# EAGLE schematic MotoRecoPico (EAGLE 9.6.2)
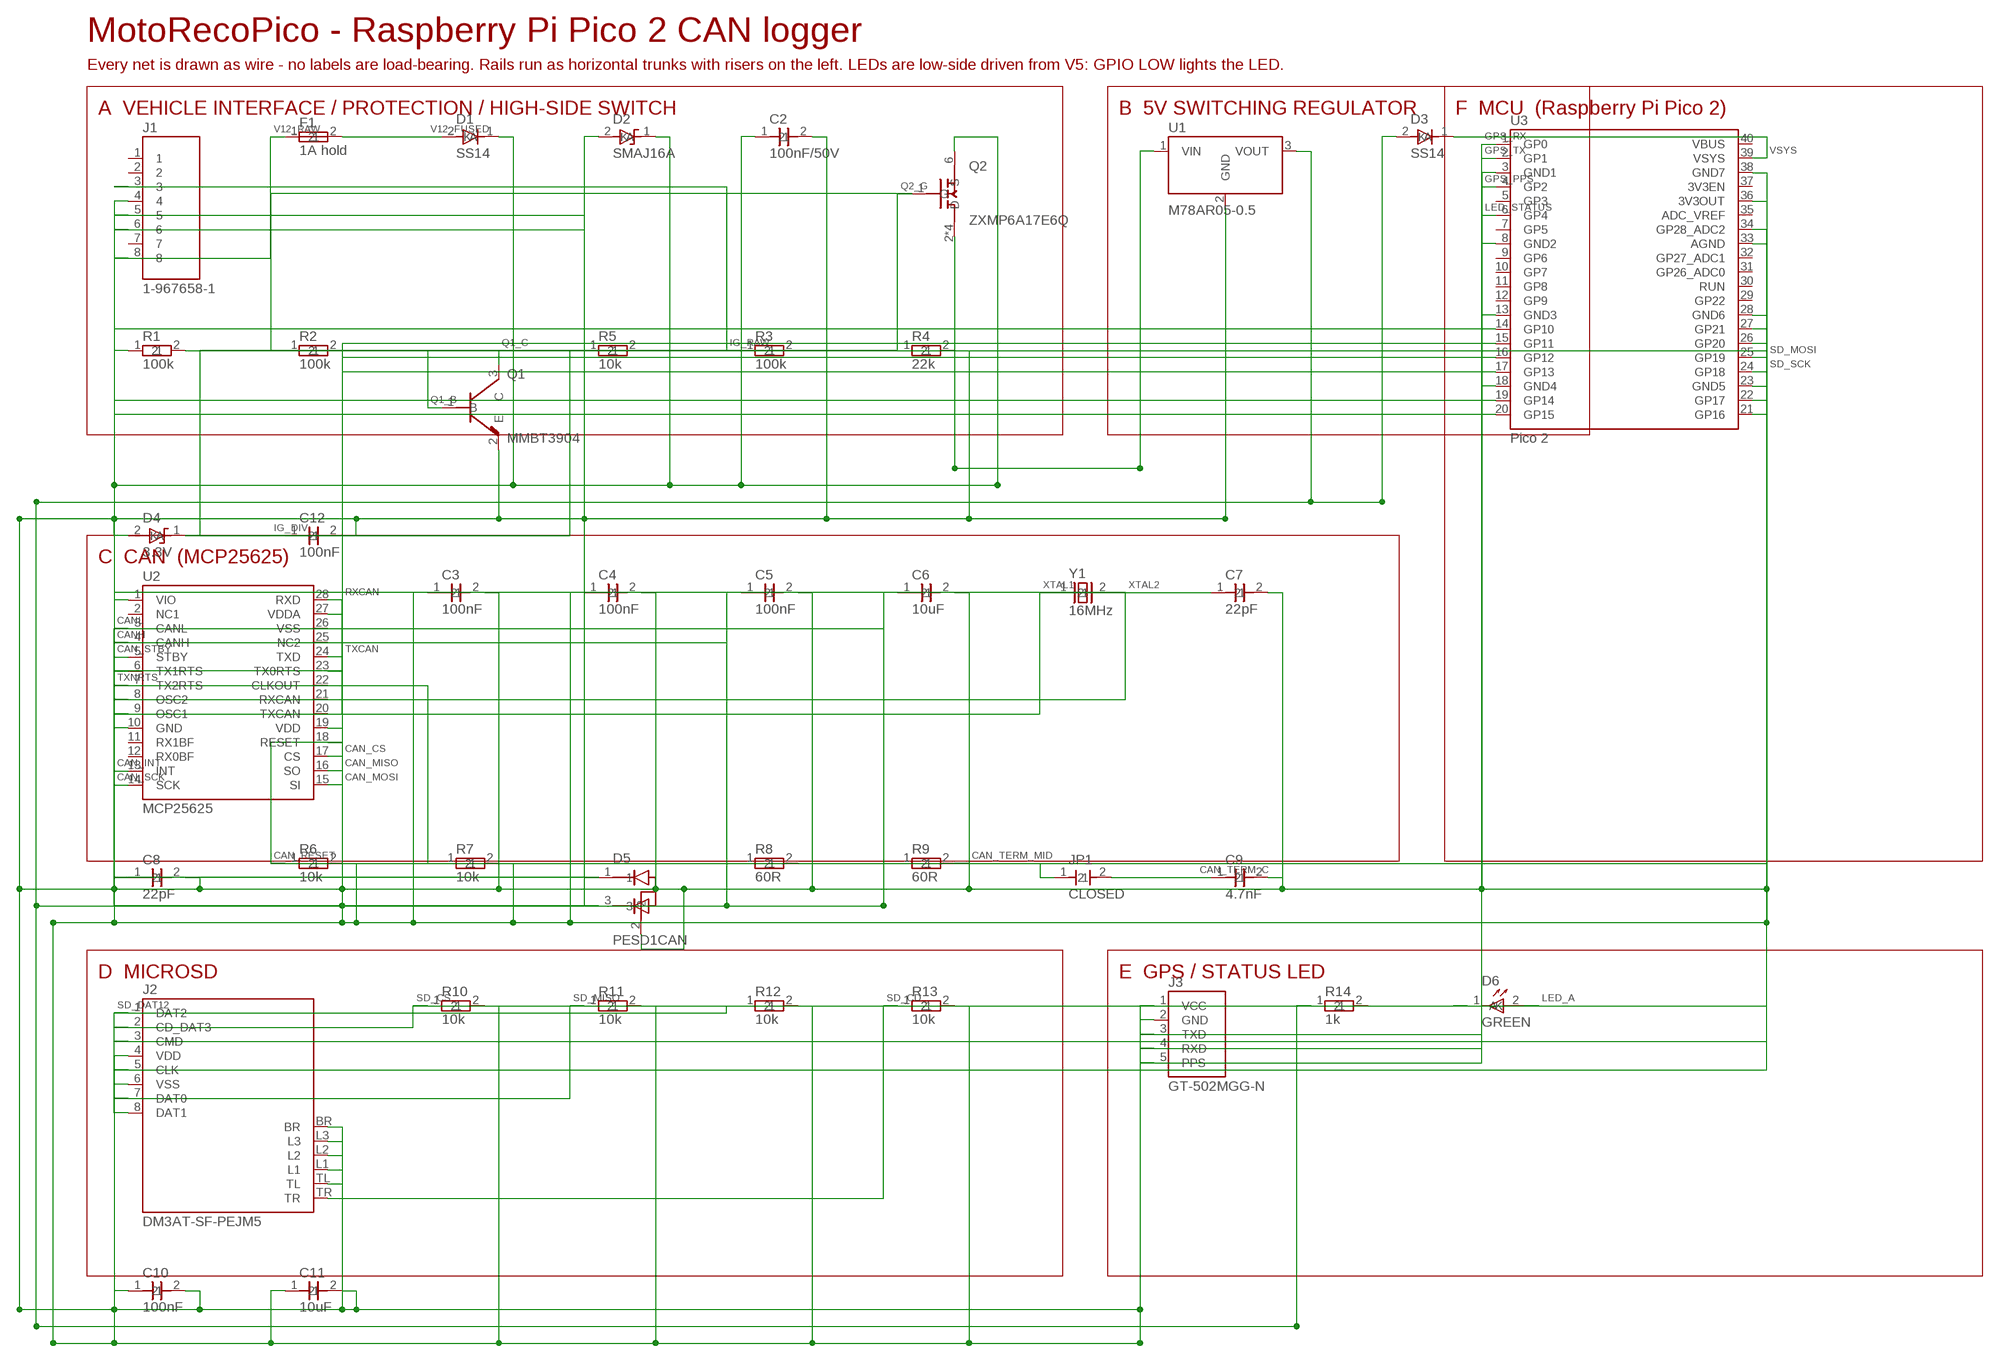
[diagram p0: schematic, sheet 1]

## Parts
C2  100nF/50V  C  [C1005]
C3  100nF  C  [C1005]
C4  100nF  C  [C1005]
C5  100nF  C  [C1005]
C6  10uF  C-1608  [C1608]
C7  22pF  C  [C1005]
C8  22pF  C  [C1005]
C9  4.7nF  C  [C1005]
C10  100nF  C  [C1005]
C11  10uF  C-1608  [C1608]
C12  100nF  C  [C1005]
D1  SS14  SCHOTTKY-1A  [SOD123]
D2  SMAJ16A  TVS-SMA  [SMA]
D3  SS14  SCHOTTKY-1A  [SOD123]
D4  3.3V  ZENER-3V3  [SOD123]
D5  PESD1CAN  [SOT23]
D6  GREEN  LED-SIDEVIEW  [LED-SIDE-2812]
F1  1A hold  PTC-FUSE  [C1206]
J1  1-967658-1  MQS-8-967658  [MQS-8-RA-967658]
J2  DM3AT-SF-PEJM5  MICROSD-DM3AT-SF-PEJM5  [MICROSD-DM3AT]
J3  GT-502MGG-N  [GPS-5P-SMD]
JP1  CLOSED  SOLDER-JUMPER  [SJ2]
Q1  MMBT3904  [SOT23]
Q2  ZXMP6A17E6Q  ZXMP6A17  [SOT26]
R1  100k  R  [C1005]
R2  100k  R  [C1005]
R3  100k  R  [C1005]
R4  22k  R  [C1005]
R5  10k  R  [C1005]
R6  10k  R  [C1005]
R7  10k  R  [C1005]
R8  60R  R  [C1005]
R9  60R  R  [C1005]
R10  10k  R  [C1005]
R11  10k  R  [C1005]
R12  10k  R  [C1005]
R13  10k  R  [C1005]
R14  1k  R  [C1005]
U1  M78AR05-0.5  [SIP3-M78AR05]
U2  MCP25625  MCP25625T-E/SS  [SSOP28]
U3  Pico 2  RPI-PICO2  [RPI-PICO2-THT]
Y1  16MHz  CRYSTAL  [HC49S]

## Nets
CAN_CS: U2.17(CS) U3.17(GP13)
CAN_INT: U2.13(INT) U3.19(GP14)
CAN_MISO: U2.16(SO) U3.16(GP12)
CAN_MOSI: U2.15(SI) U3.15(GP11)
CAN_RESET: R6.1 U2.18(RESET) U3.26(GP20)
CAN_SCK: U2.14(SCK) U3.14(GP10)
CAN_STBY: U2.5(STBY) U3.20(GP15)
CAN_TERM_C: C9.1 JP1.2
CAN_TERM_MID: JP1.1 R8.2 R9.2
CANH: D5.1 J1.6 R8.1 U2.4(CANH)
CANL: D5.3 J1.5 R9.1 U2.3(CANL)
GND: C2.2 C3.2 C4.2 C5.2 C6.2 C7.2 C8.2 C9.2 C10.2 C11.2 C12.2 D2.2(A) D4.2(A) D5.2 J1.4 J2.6(VSS) J2.BR J2.L1 J2.L2 J2.L3 J2.TL J3.2(GND) Q1.2(E) R4.2 U1.2(GND) U2.10(GND) U2.26(VSS) U3.3(GND1) U3.8(GND2) U3.13(GND3) U3.18(GND4) U3.23(GND5) U3.28(GND6) U3.33(AGND) U3.38(GND7)
GPS_PPS: J3.5(PPS) U3.4(GP2)
GPS_RX: J3.4(RXD) U3.1(GP0)
GPS_TX: J3.3(TXD) U3.2(GP1)
IG_DIV: C12.1 D4.1(K) R3.2 R4.1 R5.1 U3.34(GP28_ADC2)
IG_RAW: J1.3 R3.1
LED_A: D6.2(A) R14.2
LED_STATUS: D6.1(K) U3.6(GP4)
Q1_B: Q1.1(B) R5.2
Q1_C: Q1.3(C) R2.2
Q2_G: Q2.1(G) R1.2 R2.1
RXCAN: U2.21(RXCAN) U2.28(RXD)
SD_CD: J2.TR R13.1 U3.27(GP21)
SD_CS: J2.2(CD_DAT3) R10.1 U3.22(GP17)
SD_DAT12: J2.1(DAT2) J2.8(DAT1) R12.1
SD_MISO: J2.7(DAT0) R11.1 U3.21(GP16)
SD_MOSI: J2.3(CMD) U3.25(GP19)
SD_SCK: J2.5(CLK) U3.24(GP18)
TXCAN: U2.20(TXCAN) U2.24(TXD)
TXNRTS: R7.1 U2.6(TX1RTS) U2.7(TX2RTS) U2.23(TX0RTS)
V3V3: C3.1 C4.1 C10.1 C11.1 J2.4(VDD) J3.1(VCC) R6.2 R7.2 R10.2 R11.2 R12.2 R13.2 U2.1(VIO) U2.19(VDD) U3.36(3V3OUT)
V5: C5.1 C6.1 D3.2(A) R14.1 U1.3(VOUT) U2.27(VDDA)
V12_FUSED: D1.2(A) F1.2
V12_RAW: F1.1 J1.8
V12_SW: Q2.2(D) Q2.3(D) Q2.4(D) Q2.5(D) U1.1(VIN)
V12P: C2.1 D1.1(K) D2.1(K) Q2.6(S) R1.1
VSYS: D3.1(K) U3.39(VSYS)
XTAL1: C7.1 U2.9(OSC1) Y1.1
XTAL2: C8.1 U2.8(OSC2) Y1.2
Unconnected: J1.1 J1.2 J1.7 U2.2(NC1) U2.11(RX1BF) U2.12(RX0BF) U2.22(CLKOUT) U2.25(NC2) U3.5(GP3) U3.7(GP5) U3.9(GP6) U3.10(GP7) U3.11(GP8) U3.12(GP9) U3.29(GP22) U3.30(RUN) U3.31(GP26_ADC0) U3.32(GP27_ADC1) U3.35(ADC_VREF) U3.37(3V3EN) U3.40(VBUS)

## Notes on the sheet
- MotoRecoPico - Raspberry Pi Pico 2 CAN logger
- Every net is drawn as wire - no labels are load-bearing. Rails run as horizontal trunks with risers on the left. LEDs are low-side driven from V5: GPIO LOW lights the LED.
- A  VEHICLE INTERFACE / PROTECTION / HIGH-SIDE SWITCH | B  5V SWITCHING REGULATOR | F  MCU  (Raspberry Pi Pico 2)
- C  CAN  (MCP25625)
- D  MICROSD | E  GPS / STATUS LED

## Library data of the parts
C2-C12 = MotoRecoPico:C: Chip capacitor. Default device is 1005 metric (0402). Use the -1608 device for the 10uF bulk capacitors, which are not practically obtainable in 1005.
D1 D3 = MotoRecoPico:SCHOTTKY-1A: Schottky diode, 1A / 40V (SS14, B140 or similar), SOD-123. D1 = reverse-polarity protection in series with the 12V feed. D3 = VSYS feed, diode-ORed with the Pico USB input. Sized for the real 200mA load - the previous 3A SMA part was 15x oversized.
D2 = MotoRecoPico:TVS-SMA: Unidirectional TVS in SMA. D2 = SMAJ16A, 400W, on the 12V input. Standoff 16V clears the 14.4V charging rail; clamping is 26.0V max. 26V matters: with no external input capacitor U1 is rated 28V, not 32V (the 32V figure in the M78AR05 datasheet requires a 22uF/50V input cap). SMAJ18A would clamp at 29.2V and overshoot that limit - do not substitute it. TVS size is surge energy, so this is the one part not shrunk casually: SMA is 400W where SMB would be 600W.
D4 = MotoRecoPico:ZENER-3V3: 3.3V zener, SOD-123. D4 clamps the divided IG sense line to protect the ADC.
D5 = MotoRecoPico:PESD1CAN: PESD1CAN dual TVS array for CAN, SOT-23. Pin 2 is ground; pins 1 and 3 go to CANH and CANL. The device is symmetric so the bus pins may be swapped.
D6 = MotoRecoPico:LED-SIDEVIEW: Side-view chip LED, 2.8 x 1.2 x 0.8mm. One footprint fits both fitted parts: D10 = Kodenshi LP812-010(T) green (Akizuki 116854), VF 2.8-3.0V D11 = Sharp GM4ZR83200AE red (Akizuki 105328), VF 2.1V typ / 2.6V max Driven low-side from the 5V rail through 1k, so the GPIO sinks the current and LOW LIGHTS THE LED. The green part cannot be driven from 3.3V - its VF leaves only 0.3V of headroom there. Keep the current near 2-3mA: the red part derates 0.27mA/C and allows only about 3.8mA at 85C. Use blinking rather than more current for visibility.
F1 = MotoRecoPico:PTC-FUSE: Resettable PTC fuse, 1206. F1 = 1A hold. Rated for the 1A hold value because PTC hold current derates heavily with temperature - a 0.5A part holds only about 0.25A at 85C, too close to the 250mA peak load, and would nuisance-trip.
J1 = MotoRecoPico:MQS-8-967658: TE 1-967658-1 vehicle interface connector (MQS .63, 8 way, right angle). MotoRecoPico assignment: 3=IG 12V, 4=GND, 5=CAN Low, 6=CAN High, 8=12V permanent. Pins 1, 2, 7 unused.
J2 = MotoRecoPico:MICROSD-DM3AT-SF-PEJM5: Hirose DM3AT-SF-PEJM5 microSD socket, push-push, card detect, 0.5A, 10000 cycles. Hand soldering is supported by Hirose (iron 350C for 3s). SPI mode wiring: CD_DAT3=CS, CMD=MOSI, CLK=SCK, DAT0=MISO, VDD=3.3V, VSS=GND. DAT1 and DAT2 are unused in SPI mode but should be pulled up per the SD spec. Card detect switch is normally open and closes when a card is inserted. The six auxiliary pads (TL, TR, L1, L2, L3, BR) are the stainless cover ground legs plus the two card-detect switch terminals. From the Hirose drawing the switch is most likely TR (drawing calls out card-detect(B) at the right end of the contact row) and BR (card-detect(A) on the lower right flank); the remaining four are ground legs. VERIFY WITH A CONTINUITY CHECK before committing the schematic: the two switch pads are the pair that goes from open to shorted when a card is inserted. Everything else goes to GND.
J3 = MotoRecoPico:GT-502MGG-N: GT-502MGG-N GNSS receiver, external module with a 1.5m bare-wire cable. Wires solder to surface pads on one face only. Supply is the Pico 3V3(OUT): 50mA on top of the SD and CAN loads still leaves margin under the 300mA recommended limit. 3.3V also keeps its UART levels safe for the Pico.
JP1 = MotoRecoPico:SOLDER-JUMPER: Two-pad solder jumper. JP1 breaks the CAN split-termination midpoint. DEFAULT STATE IS CLOSED - open it only to rule out over-termination on a bus that is already terminated at both ends.
Q1 = MotoRecoPico:MMBT3904: MMBT3904 NPN, SOT-23. Q1 pulls the LM2596 ON/OFF pin low to enable the supply.
Q2 = MotoRecoPico:ZXMP6A17: Diodes ZXMP6A17E6Q P-channel MOSFET, SOT-26. -60V, -3.0A, Vgs +/-20V, Rds(on) 125mOhm at Vgs=-10V and 190mOhm at -4.5V. AEC-Q101 qualified. High-side switch for the 12V feed, turned on by the vehicle IG signal. Gate is driven by a 100k/100k divider so Vgs is always half the supply: 6V at 12V in, 7.2V at 14.4V, 14.6V at the 29.2V TVS clamp - always inside the +/-20V rating and always fully enhanced, with no gate zener needed. Drain is four pads (thermal path) tied to one terminal.
R1-R14 = MotoRecoPico:R: Chip resistor, 0805.
U1 = MotoRecoPico:M78AR05-0.5: MinMax M78AR05-0.5 switching regulator module, 6.5-32V in, 5V 500mA out. Drop-in for an LM7805 but switching, so no heatsink is needed. Inductor and capacitors are inside the module - no external switching components. Short-circuit protection, thermal shutdown, 1A output current limit. NO ENABLE PIN, which is why Q2 switches its input instead. Needs 22uF/50V on the input to be rated for 32V (datasheet note 7). No-load input current is 5mA, so it must never sit on permanent 12V unswitched. Recommended input fuse for the 5V model is 1A slow-blow - that is F1.
U2 = MotoRecoPico:MCP25625: Microchip MCP25625 CAN 2.0B controller with integrated transceiver, SSOP-28. VDDA must be 5V. VDD and VIO tie to 3.3V for direct connection to a 3.3V MCU with no level shifters. TXD must be wired to TXCAN and RXD to RXCAN on the PCB.
U3 = MotoRecoPico:RPI-PICO2: Raspberry Pi Pico 2 (RP2350) module. MotoRecoPico usage: SPI1 (GP10-13) to MCP25625, SPI0 (GP16-19) to MicroSD, UART0 (GP0/GP1) to GPS, GP2 = 1PPS, GP3 = IG sense, GP22 = KEEP_ALIVE, GP28 = battery voltage sense. VSYS fed from the 5V rail via a Schottky diode.
Y1 = MotoRecoPico:CRYSTAL: HC-49/S through-hole crystal. Y1 = 16MHz for the MCP25625. 16MHz divides exactly for 500k, 250k and 125k bit rates.